# Altium schematic sheet LCD.SchDoc: Bison-Board
size A4; DrawnBy: mzy2364; Revision: V1.4
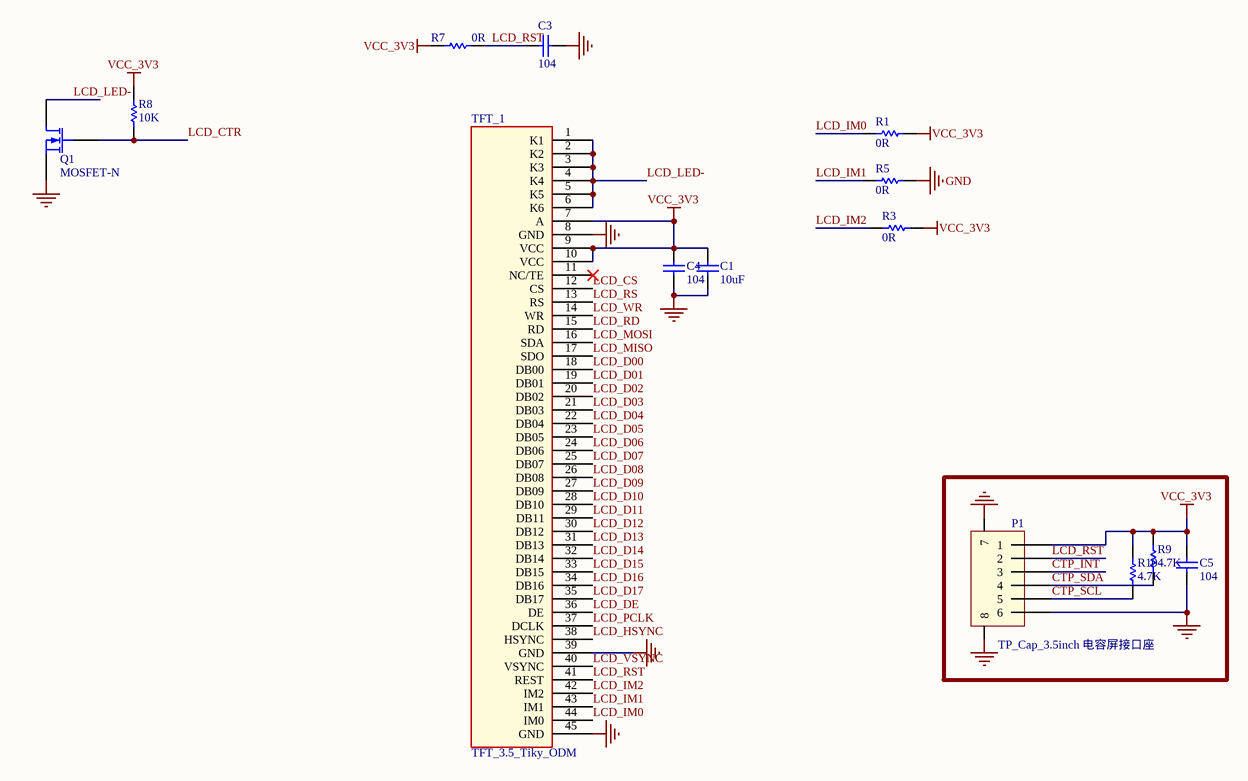
[diagram p0: LCD.SchDoc]

## Parts
C1  10uF  [C 0603]
C3  104  [C 0603]
C4  104  [C 0603]
C5  104  [C 0603]
P1  TP_Cap_3.5inch 电容屏接口座  [TP_Cap_3.5inch]
Q1  MOSFET-N  [SOT-23]
R1  0R  [R 0603]
R3  0R  [R 0603]
R5  0R  [R 0603]
R7  0R  [R 0603]
R8  10K  [R 0603]
R9  4.7K  [R 0603]
R10  4.7K  [R 0603]
TFT_1  TFT_3.5_Tiky_ODM  [TFT_3.5_TIKY_ODM]

## Nets
GND: C1.2 C3.1 C4.2 C5.2 P1.6 P1.7 P1.8 Q1.2(S) R5.2 TFT_1.8(GND) TFT_1.39(GND) TFT_1.45(GND)
VCC_3V3: C1.1 C4.1 C5.1 P1.1 R1.2 R3.2 R7.1 R8.2 R9.2 R10.2 TFT_1.7(A) TFT_1.9(VCC) TFT_1.10(VCC)
CTP_INT: P1.3
CTP_SCL: P1.5 R10.1
CTP_SDA: P1.4 R9.1
LCD_CS: TFT_1.12(CS)
LCD_CTR: Q1.1(G) R8.1
LCD_D00: TFT_1.18(DB00)
LCD_D01: TFT_1.19(DB01)
LCD_D02: TFT_1.20(DB02)
LCD_D03: TFT_1.21(DB03)
LCD_D04: TFT_1.22(DB04)
LCD_D05: TFT_1.23(DB05)
LCD_D06: TFT_1.24(DB06)
LCD_D07: TFT_1.25(DB07)
LCD_D08: TFT_1.26(DB08)
LCD_D09: TFT_1.27(DB09)
LCD_D10: TFT_1.28(DB10)
LCD_D11: TFT_1.29(DB11)
LCD_D12: TFT_1.30(DB12)
LCD_D13: TFT_1.31(DB13)
LCD_D14: TFT_1.32(DB14)
LCD_D15: TFT_1.33(DB15)
LCD_D16: TFT_1.34(DB16)
LCD_D17: TFT_1.35(DB17)
LCD_DE: TFT_1.36(DE)
LCD_HSYNC: TFT_1.38(HSYNC)
LCD_IM0: R1.1 TFT_1.44(IM0)
LCD_IM1: R5.1 TFT_1.43(IM1)
LCD_IM2: R3.1 TFT_1.42(IM2)
LCD_LED-: Q1.3(D) TFT_1.1(K1) TFT_1.2(K2) TFT_1.3(K3) TFT_1.4(K4) TFT_1.5(K5) TFT_1.6(K6)
LCD_MISO: TFT_1.17(SDO)
LCD_MOSI: TFT_1.16(SDA)
LCD_PCLK: TFT_1.37(DCLK)
LCD_RD: TFT_1.15(RD)
LCD_RS: TFT_1.13(RS)
LCD_RST: C3.2 P1.2 R7.2 TFT_1.41(REST)
LCD_VSYNC: TFT_1.40(VSYNC)
LCD_WR: TFT_1.14(WR)

Not connected (* = marked no-connect by the designer): TFT_1 11(NC/TE)*

## Library data of the parts
C1 C4 C5 = Cap: Capacitor
C3 = CAP
P1 = BHEADSMD1x6
R1 R3 R5 R7-R10 = RES